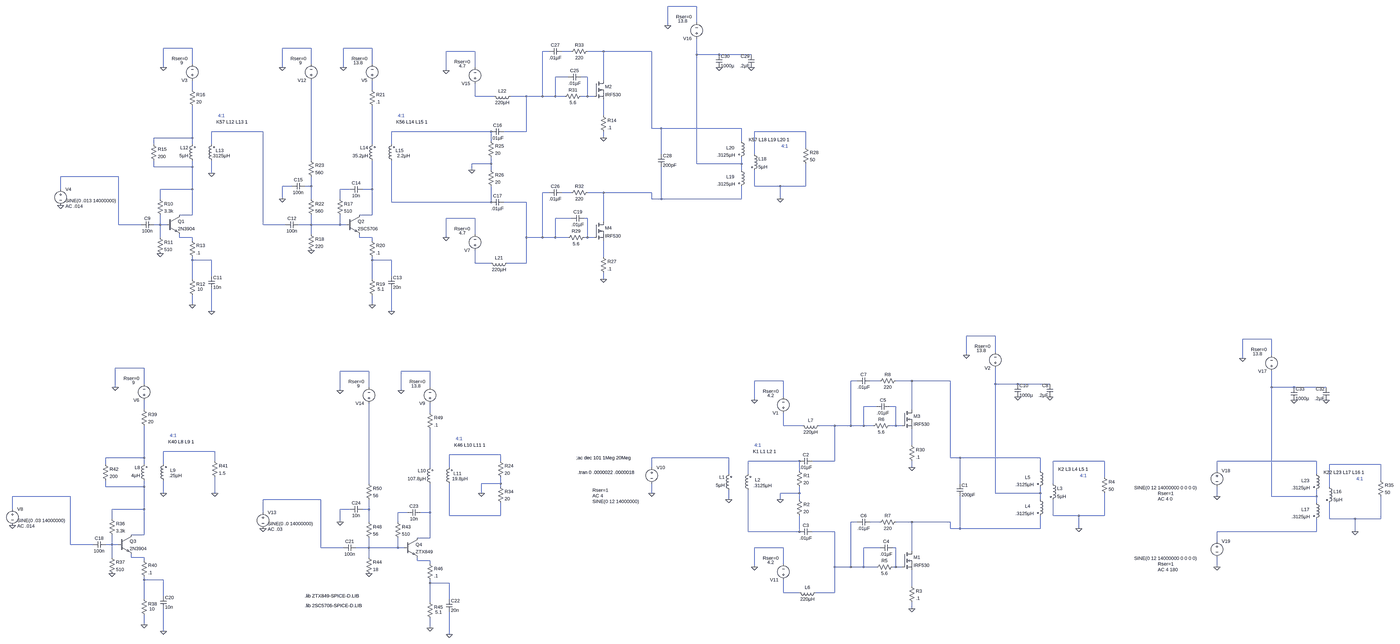
[diagram p0: schematic RF_AMP_2078_V306.asc, whole sheet]
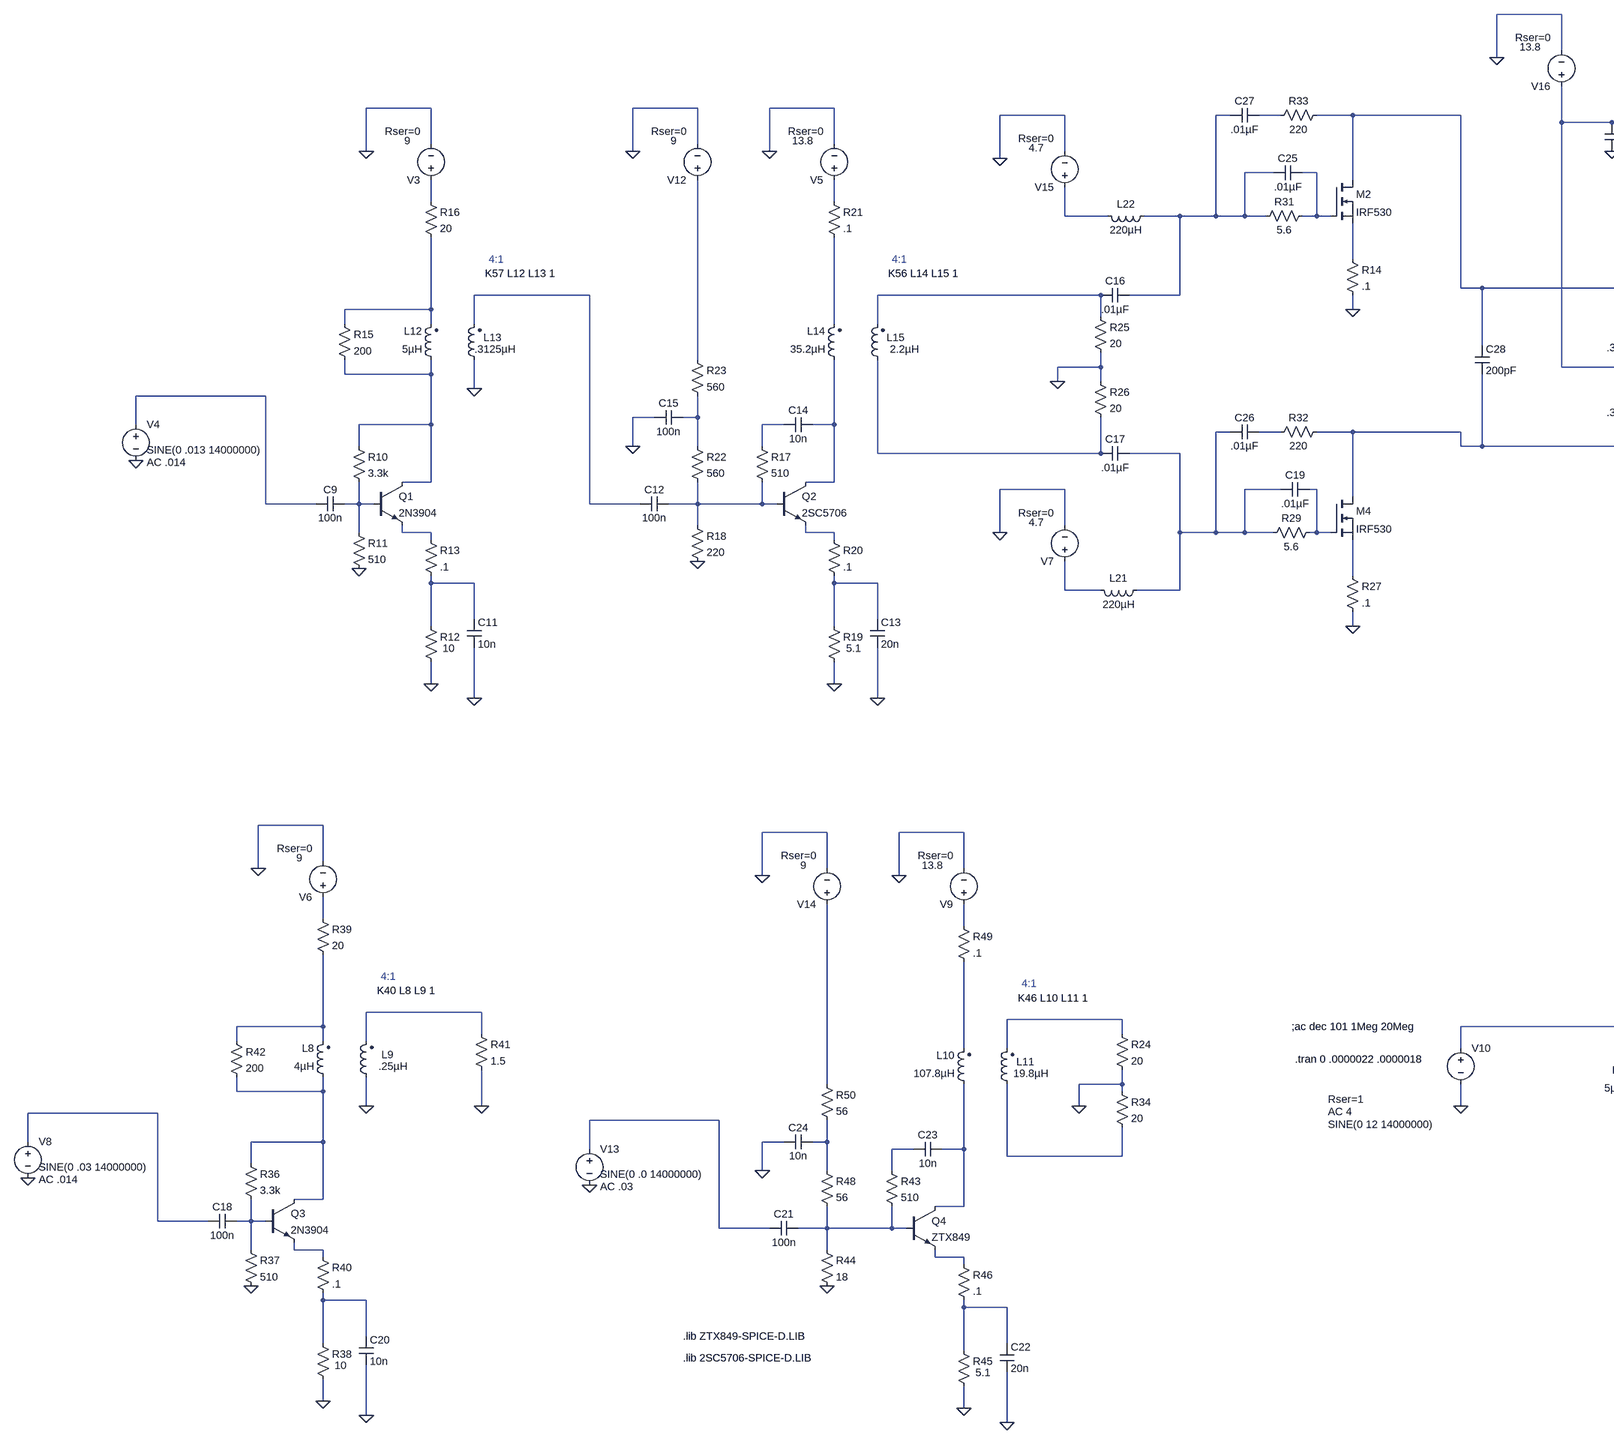
[diagram p1: schematic RF_AMP_2078_V306.asc, part, row 1 of 1, column 1 of 2]
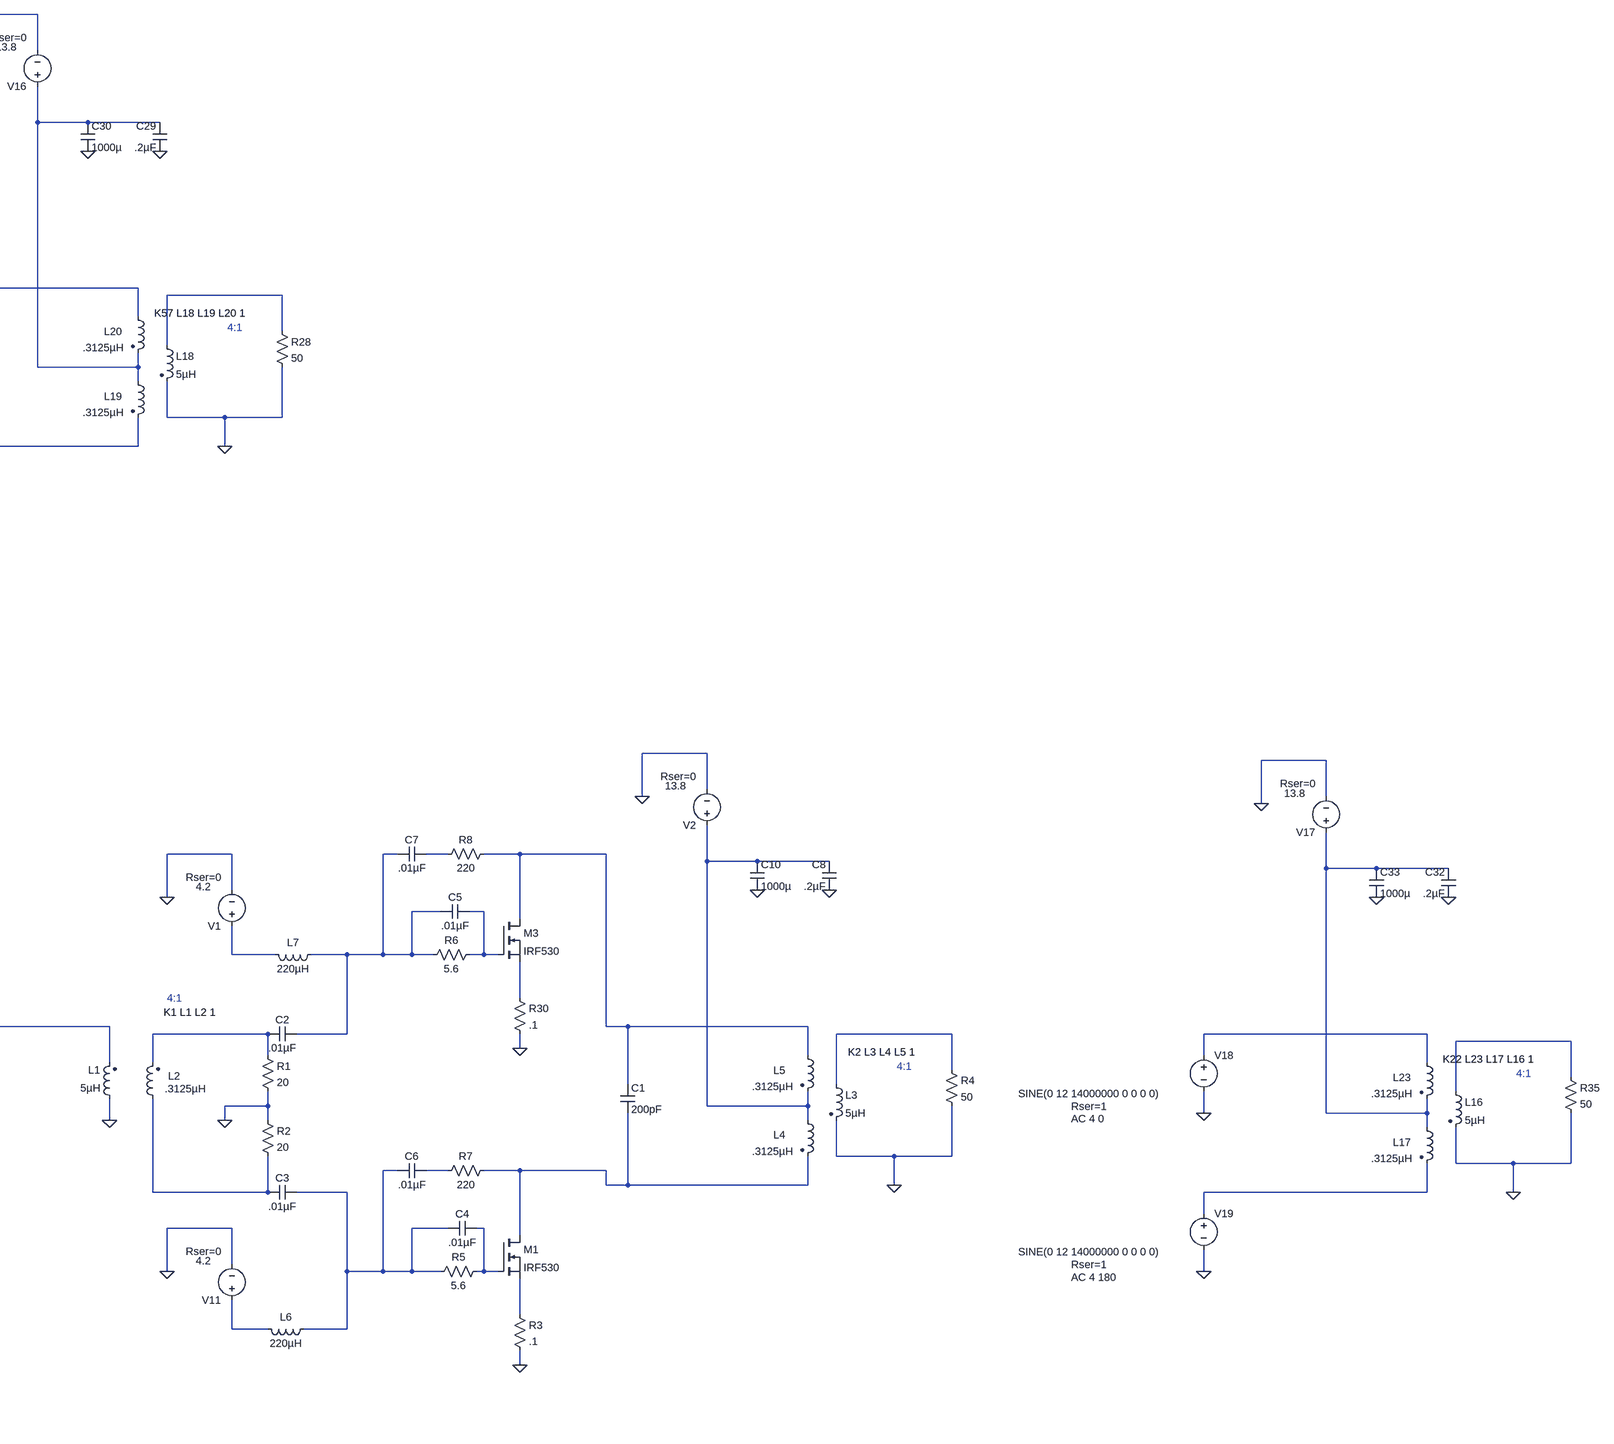
[diagram p2: schematic RF_AMP_2078_V306.asc, part, row 1 of 1, column 2 of 2]
RF_AMP_2078_V306.asc, the LTspice schematic file:
Version 4
SHEET 1 5652 1240
WIRE 2128 -4224 1984 -4224
WIRE 2128 -4144 2128 -4224
WIRE 1984 -4128 1984 -4224
WIRE -384 -4016 -528 -4016
WIRE 208 -4016 64 -4016
WIRE 512 -4016 368 -4016
WIRE 1024 -4000 880 -4000
WIRE 1392 -4000 1360 -4000
WIRE 1504 -4000 1456 -4000
WIRE 1664 -4000 1584 -4000
WIRE 1904 -4000 1664 -4000
WIRE 2128 -3984 2128 -4064
WIRE 2240 -3984 2128 -3984
WIRE 2400 -3984 2240 -3984
WIRE -384 -3936 -384 -4016
WIRE 208 -3936 208 -4016
WIRE 512 -3936 512 -4016
WIRE -528 -3920 -528 -4016
WIRE 64 -3920 64 -4016
WIRE 368 -3920 368 -4016
WIRE 1024 -3920 1024 -4000
WIRE 880 -3904 880 -4000
WIRE 1488 -3872 1424 -3872
WIRE 1584 -3872 1552 -3872
WIRE 1664 -3856 1664 -4000
WIRE -384 -3808 -384 -3856
WIRE 512 -3808 512 -3856
WIRE 1024 -3776 1024 -3840
WIRE 1120 -3776 1024 -3776
WIRE 1280 -3776 1200 -3776
WIRE 1360 -3776 1360 -4000
WIRE 1360 -3776 1280 -3776
WIRE 1424 -3776 1424 -3872
WIRE 1424 -3776 1360 -3776
WIRE 1472 -3776 1424 -3776
WIRE 1584 -3776 1584 -3872
WIRE 1584 -3776 1552 -3776
WIRE 1616 -3776 1584 -3776
WIRE 1664 -3680 1664 -3760
WIRE 1904 -3616 1904 -4000
WIRE 1952 -3616 1904 -3616
WIRE 2352 -3616 1952 -3616
WIRE -32 -3600 -288 -3600
WIRE 1104 -3600 608 -3600
WIRE 1280 -3600 1280 -3776
WIRE 1280 -3600 1168 -3600
WIRE 2672 -3600 2416 -3600
WIRE -384 -3568 -384 -3728
WIRE -384 -3568 -576 -3568
WIRE 1664 -3568 1664 -3600
WIRE 1104 -3552 1104 -3600
WIRE 2352 -3552 2352 -3616
WIRE -576 -3536 -576 -3568
WIRE -384 -3536 -384 -3568
WIRE -288 -3536 -288 -3600
WIRE 512 -3536 512 -3728
WIRE 608 -3536 608 -3600
WIRE 2672 -3520 2672 -3600
WIRE 1952 -3488 1952 -3616
WIRE 2416 -3488 2416 -3600
WIRE 208 -3456 208 -3856
WIRE 1104 -3440 1104 -3472
WIRE 1104 -3440 1008 -3440
WIRE 2128 -3440 2128 -3984
WIRE 2352 -3440 2352 -3472
WIRE 2352 -3440 2128 -3440
WIRE -576 -3424 -576 -3456
WIRE -384 -3424 -384 -3456
WIRE -384 -3424 -576 -3424
WIRE 1008 -3408 1008 -3440
WIRE 1104 -3408 1104 -3440
WIRE 2352 -3408 2352 -3440
WIRE -288 -3392 -288 -3456
WIRE -752 -3376 -1040 -3376
WIRE 112 -3328 64 -3328
WIRE 208 -3328 208 -3376
WIRE 208 -3328 176 -3328
WIRE 2416 -3328 2416 -3408
WIRE 2544 -3328 2416 -3328
WIRE 2672 -3328 2672 -3440
WIRE 2672 -3328 2544 -3328
WIRE -1040 -3312 -1040 -3376
WIRE -384 -3312 -384 -3424
WIRE -384 -3312 -544 -3312
WIRE 400 -3312 352 -3312
WIRE 512 -3312 512 -3456
WIRE 512 -3312 464 -3312
WIRE 1392 -3296 1360 -3296
WIRE 1504 -3296 1456 -3296
WIRE 1664 -3296 1584 -3296
WIRE 1904 -3296 1664 -3296
WIRE -544 -3264 -544 -3312
WIRE 64 -3264 64 -3328
WIRE 208 -3264 208 -3328
WIRE 352 -3264 352 -3312
WIRE 1904 -3264 1904 -3296
WIRE 1952 -3264 1952 -3424
WIRE 1952 -3264 1904 -3264
WIRE 2352 -3264 2352 -3328
WIRE 2352 -3264 1952 -3264
WIRE 2544 -3264 2544 -3328
WIRE 608 -3248 608 -3456
WIRE 1104 -3248 1104 -3328
WIRE 1104 -3248 608 -3248
WIRE 1280 -3248 1168 -3248
WIRE -384 -3184 -384 -3312
WIRE -384 -3184 -448 -3184
WIRE 512 -3184 512 -3312
WIRE 512 -3184 448 -3184
WIRE 1024 -3168 880 -3168
WIRE 1504 -3168 1424 -3168
WIRE 1584 -3168 1568 -3168
WIRE 1664 -3152 1664 -3296
WIRE -752 -3136 -752 -3376
WIRE -640 -3136 -752 -3136
WIRE -544 -3136 -544 -3184
WIRE -544 -3136 -576 -3136
WIRE -512 -3136 -544 -3136
WIRE -32 -3136 -32 -3600
WIRE 80 -3136 -32 -3136
WIRE 208 -3136 208 -3184
WIRE 208 -3136 144 -3136
WIRE 352 -3136 352 -3184
WIRE 352 -3136 208 -3136
WIRE 384 -3136 352 -3136
WIRE 208 -3088 208 -3136
WIRE 1024 -3088 1024 -3168
WIRE -544 -3072 -544 -3136
WIRE -448 -3072 -448 -3088
WIRE -384 -3072 -448 -3072
WIRE 448 -3072 448 -3088
WIRE 512 -3072 448 -3072
WIRE 880 -3072 880 -3168
WIRE 1280 -3072 1280 -3248
WIRE 1360 -3072 1360 -3296
WIRE 1360 -3072 1280 -3072
WIRE 1424 -3072 1424 -3168
WIRE 1424 -3072 1360 -3072
WIRE 1488 -3072 1424 -3072
WIRE 1584 -3072 1584 -3168
WIRE 1584 -3072 1568 -3072
WIRE 1616 -3072 1584 -3072
WIRE -384 -3056 -384 -3072
WIRE 512 -3056 512 -3072
WIRE 1664 -2976 1664 -3056
WIRE -384 -2960 -384 -2976
WIRE -288 -2960 -384 -2960
WIRE 512 -2960 512 -2976
WIRE 608 -2960 512 -2960
WIRE 1024 -2944 1024 -3008
WIRE 1104 -2944 1024 -2944
WIRE 1280 -2944 1280 -3072
WIRE 1280 -2944 1184 -2944
WIRE -288 -2880 -288 -2960
WIRE 608 -2880 608 -2960
WIRE -384 -2864 -384 -2960
WIRE 512 -2864 512 -2960
WIRE 1664 -2864 1664 -2896
WIRE -384 -2736 -384 -2784
WIRE 512 -2736 512 -2784
WIRE -288 -2704 -288 -2816
WIRE 608 -2704 608 -2816
WIRE 3664 -2000 3520 -2000
WIRE 5040 -1984 4896 -1984
WIRE 3664 -1920 3664 -2000
WIRE 3520 -1904 3520 -2000
WIRE 5040 -1904 5040 -1984
WIRE 4896 -1888 4896 -1984
WIRE -624 -1840 -768 -1840
WIRE 496 -1824 352 -1824
WIRE 800 -1824 656 -1824
WIRE 2560 -1776 2416 -1776
WIRE 2928 -1776 2896 -1776
WIRE 3040 -1776 2992 -1776
WIRE 3200 -1776 3120 -1776
WIRE 3440 -1776 3200 -1776
WIRE -624 -1760 -624 -1840
WIRE 3664 -1760 3664 -1840
WIRE 3776 -1760 3664 -1760
WIRE 3936 -1760 3776 -1760
WIRE -768 -1744 -768 -1840
WIRE 496 -1744 496 -1824
WIRE 800 -1744 800 -1824
WIRE 5040 -1744 5040 -1824
WIRE 5152 -1744 5040 -1744
WIRE 5312 -1744 5152 -1744
WIRE 352 -1728 352 -1824
WIRE 656 -1728 656 -1824
WIRE 2560 -1696 2560 -1776
WIRE 2416 -1680 2416 -1776
WIRE 3024 -1648 2960 -1648
WIRE 3120 -1648 3088 -1648
WIRE -624 -1632 -624 -1680
WIRE 3200 -1632 3200 -1776
WIRE 800 -1616 800 -1664
WIRE 2560 -1552 2560 -1616
WIRE 2656 -1552 2560 -1552
WIRE 2816 -1552 2736 -1552
WIRE 2896 -1552 2896 -1776
WIRE 2896 -1552 2816 -1552
WIRE 2960 -1552 2960 -1648
WIRE 2960 -1552 2896 -1552
WIRE 3008 -1552 2960 -1552
WIRE 3120 -1552 3120 -1648
WIRE 3120 -1552 3088 -1552
WIRE 3152 -1552 3120 -1552
WIRE 3200 -1456 3200 -1536
WIRE -272 -1424 -528 -1424
WIRE 1152 -1408 896 -1408
WIRE -624 -1392 -624 -1552
WIRE -624 -1392 -816 -1392
WIRE 2288 -1392 1904 -1392
WIRE 3440 -1392 3440 -1776
WIRE 3488 -1392 3440 -1392
WIRE 3888 -1392 3488 -1392
WIRE -272 -1376 -272 -1424
WIRE 1152 -1376 1152 -1408
WIRE 2640 -1376 2384 -1376
WIRE 2816 -1376 2816 -1552
WIRE 2816 -1376 2704 -1376
WIRE 4208 -1376 3952 -1376
WIRE 5264 -1376 4768 -1376
WIRE -816 -1360 -816 -1392
WIRE -624 -1360 -624 -1392
WIRE -528 -1360 -528 -1424
WIRE 5584 -1360 5328 -1360
WIRE 800 -1344 800 -1536
WIRE 896 -1344 896 -1408
WIRE 1904 -1344 1904 -1392
WIRE 3200 -1344 3200 -1376
WIRE 2640 -1328 2640 -1376
WIRE 3888 -1328 3888 -1392
WIRE 4768 -1328 4768 -1376
WIRE 2288 -1312 2288 -1392
WIRE 2384 -1312 2384 -1376
WIRE 5264 -1312 5264 -1376
WIRE 4208 -1296 4208 -1376
WIRE 5584 -1280 5584 -1360
WIRE 496 -1264 496 -1664
WIRE 1152 -1264 1152 -1296
WIRE 1152 -1264 1056 -1264
WIRE 3488 -1264 3488 -1392
WIRE 3952 -1264 3952 -1376
WIRE -816 -1248 -816 -1280
WIRE -624 -1248 -624 -1280
WIRE -624 -1248 -816 -1248
WIRE 1152 -1248 1152 -1264
WIRE 5328 -1248 5328 -1360
WIRE -528 -1216 -528 -1280
WIRE -272 -1216 -272 -1296
WIRE 1056 -1216 1056 -1264
WIRE 1904 -1216 1904 -1264
WIRE 2640 -1216 2640 -1248
WIRE 2640 -1216 2544 -1216
WIRE 3664 -1216 3664 -1760
WIRE 3888 -1216 3888 -1248
WIRE 3888 -1216 3664 -1216
WIRE -992 -1200 -1280 -1200
WIRE 4768 -1200 4768 -1248
WIRE 5040 -1200 5040 -1744
WIRE 5264 -1200 5264 -1232
WIRE 5264 -1200 5040 -1200
WIRE 256 -1184 -32 -1184
WIRE 2288 -1184 2288 -1232
WIRE 2544 -1184 2544 -1216
WIRE 2640 -1184 2640 -1216
WIRE 3888 -1184 3888 -1216
WIRE 5264 -1168 5264 -1200
WIRE -1280 -1136 -1280 -1200
WIRE -624 -1136 -624 -1248
WIRE -624 -1136 -784 -1136
WIRE 400 -1136 352 -1136
WIRE 496 -1136 496 -1184
WIRE 496 -1136 464 -1136
WIRE -32 -1120 -32 -1184
WIRE 688 -1120 640 -1120
WIRE 800 -1120 800 -1264
WIRE 800 -1120 752 -1120
WIRE 896 -1104 896 -1264
WIRE 1152 -1104 1152 -1168
WIRE 1152 -1104 896 -1104
WIRE 3952 -1104 3952 -1184
WIRE 4080 -1104 3952 -1104
WIRE 4208 -1104 4208 -1216
WIRE 4208 -1104 4080 -1104
WIRE -784 -1088 -784 -1136
WIRE 5328 -1088 5328 -1168
WIRE 5456 -1088 5328 -1088
WIRE 5584 -1088 5584 -1200
WIRE 5584 -1088 5456 -1088
WIRE 352 -1072 352 -1136
WIRE 496 -1072 496 -1136
WIRE 640 -1072 640 -1120
WIRE 2928 -1072 2896 -1072
WIRE 3040 -1072 2992 -1072
WIRE 3200 -1072 3120 -1072
WIRE 3440 -1072 3200 -1072
WIRE 3440 -1040 3440 -1072
WIRE 3488 -1040 3488 -1200
WIRE 3488 -1040 3440 -1040
WIRE 3888 -1040 3888 -1104
WIRE 3888 -1040 3488 -1040
WIRE 4080 -1040 4080 -1104
WIRE 2384 -1024 2384 -1232
WIRE 2640 -1024 2640 -1104
WIRE 2640 -1024 2384 -1024
WIRE 2816 -1024 2704 -1024
WIRE 5264 -1024 5264 -1088
WIRE 5264 -1024 4768 -1024
WIRE 5456 -1024 5456 -1088
WIRE -624 -1008 -624 -1136
WIRE -624 -1008 -688 -1008
WIRE 800 -992 800 -1120
WIRE 800 -992 736 -992
WIRE 4768 -976 4768 -1024
WIRE -992 -960 -992 -1200
WIRE -880 -960 -992 -960
WIRE -784 -960 -784 -1008
WIRE -784 -960 -816 -960
WIRE -752 -960 -784 -960
WIRE 256 -944 256 -1184
WIRE 368 -944 256 -944
WIRE 496 -944 496 -992
WIRE 496 -944 432 -944
WIRE 640 -944 640 -992
WIRE 640 -944 496 -944
WIRE 672 -944 640 -944
WIRE 2560 -944 2416 -944
WIRE 3040 -944 2960 -944
WIRE 3120 -944 3104 -944
WIRE 3200 -928 3200 -1072
WIRE -784 -896 -784 -960
WIRE -688 -896 -688 -912
WIRE -624 -896 -688 -896
WIRE 496 -896 496 -944
WIRE -624 -880 -624 -896
WIRE 736 -880 736 -896
WIRE 800 -880 736 -880
WIRE 800 -864 800 -880
WIRE 2560 -864 2560 -944
WIRE 2416 -848 2416 -944
WIRE 2816 -848 2816 -1024
WIRE 2896 -848 2896 -1072
WIRE 2896 -848 2816 -848
WIRE 2960 -848 2960 -944
WIRE 2960 -848 2896 -848
WIRE 3024 -848 2960 -848
WIRE 3120 -848 3120 -944
WIRE 3120 -848 3104 -848
WIRE 3152 -848 3120 -848
WIRE 4768 -848 4768 -896
WIRE -624 -784 -624 -800
WIRE -528 -784 -624 -784
WIRE 800 -768 800 -784
WIRE 896 -768 800 -768
WIRE 3200 -752 3200 -832
WIRE 2560 -720 2560 -784
WIRE 2640 -720 2560 -720
WIRE 2816 -720 2816 -848
WIRE 2816 -720 2720 -720
WIRE -528 -704 -528 -784
WIRE -624 -688 -624 -784
WIRE 896 -688 896 -768
WIRE 800 -672 800 -768
WIRE 3200 -640 3200 -672
WIRE -624 -560 -624 -608
WIRE 800 -544 800 -592
WIRE -528 -528 -528 -640
WIRE 896 -512 896 -624
FLAG 1904 -1216 0
FLAG 3200 -1344 0
FLAG -768 -1744 0
FLAG -784 -816 0
FLAG -624 -560 0
FLAG -528 -528 0
FLAG -528 -1216 0
FLAG -1280 -1056 0
FLAG -272 -1216 0
FLAG 656 -1728 0
FLAG 496 -816 0
FLAG 800 -544 0
FLAG 896 -512 0
FLAG -32 -1040 0
FLAG 352 -1072 0
FLAG 352 -1728 0
FLAG 2544 -1184 0
FLAG 3200 -640 0
FLAG 4080 -1040 0
FLAG 2416 -848 0
FLAG 2288 -1184 0
FLAG 2416 -1680 0
FLAG 3520 -1904 0
FLAG 3936 -1696 0
FLAG 3776 -1696 0
FLAG -528 -3920 0
FLAG -544 -2992 0
FLAG -384 -2736 0
FLAG -288 -2704 0
FLAG -288 -3392 0
FLAG -1040 -3232 0
FLAG 368 -3920 0
FLAG 208 -3008 0
FLAG 512 -2736 0
FLAG 608 -2704 0
FLAG 64 -3264 0
FLAG 64 -3920 0
FLAG 1664 -3568 0
FLAG 1008 -3408 0
FLAG 1664 -2864 0
FLAG 2544 -3264 0
FLAG 880 -3072 0
FLAG 880 -3904 0
FLAG 1984 -4128 0
FLAG 2400 -3920 0
FLAG 2240 -3920 0
FLAG 1056 -1216 0
FLAG 5456 -1024 0
FLAG 4896 -1888 0
FLAG 5312 -1680 0
FLAG 5152 -1680 0
FLAG 4768 -1200 0
FLAG 4768 -848 0
SYMBOL voltage 1904 -1360 R0
WINDOW 123 -295 157 Left 2
WINDOW 39 -295 129 Left 2
WINDOW 3 -295 185 Left 2
SYMATTR Value2 AC 4
SYMATTR SpiceLine Rser=1
SYMATTR Value SINE(0 12 14000000)
SYMATTR InstName V10
SYMBOL voltage 2560 -768 R180
WINDOW 123 0 0 Left 0
WINDOW 39 24 124 Left 2
WINDOW 3 46 103 Left 2
SYMATTR SpiceLine Rser=0
SYMATTR Value 4.2
SYMATTR InstName V11
SYMBOL nmos 3152 -1632 R0
SYMATTR InstName M3
SYMATTR Value IRF530
SYMBOL res 3184 -1472 R0
SYMATTR InstName R30
SYMATTR Value .1
SYMBOL npn -752 -1008 R0
SYMATTR InstName Q3
SYMATTR Value 2N3904
SYMBOL voltage -624 -1664 R180
WINDOW 123 0 0 Left 0
WINDOW 39 24 124 Left 2
WINDOW 3 46 103 Left 2
SYMATTR SpiceLine Rser=0
SYMATTR Value 9
SYMATTR InstName V6
SYMBOL cap -816 -976 R90
WINDOW 0 0 32 VBottom 2
WINDOW 3 32 32 VTop 2
SYMATTR InstName C18
SYMATTR Value 100n
SYMBOL res -800 -1104 R0
SYMATTR InstName R36
SYMATTR Value 3.3k
SYMBOL res -800 -912 R0
SYMATTR InstName R37
SYMATTR Value 510
SYMBOL res -640 -704 R0
WINDOW 3 42 65 Left 2
SYMATTR Value 10
SYMATTR InstName R38
SYMBOL cap -544 -704 R0
SYMATTR InstName C20
SYMATTR Value 10n
SYMBOL ind2 -608 -1264 R180
WINDOW 0 36 80 Left 2
WINDOW 3 36 40 Left 2
SYMATTR InstName L8
SYMATTR Value 4µH
SYMATTR Type ind
SYMBOL ind2 -512 -1264 R180
WINDOW 0 -45 66 Left 2
WINDOW 3 -76 40 Left 2
SYMATTR InstName L9
SYMATTR Value .25µH
SYMATTR Type ind
SYMBOL res -640 -896 R0
SYMATTR InstName R40
SYMATTR Value .1
SYMBOL voltage -1280 -1152 R0
WINDOW 123 24 100 Left 2
WINDOW 39 0 0 Left 0
WINDOW 3 24 72 Left 2
SYMATTR Value2 AC .014
SYMATTR Value SINE(0 .03 14000000)
SYMATTR InstName V8
SYMBOL res -288 -1392 R0
SYMATTR InstName R41
SYMATTR Value 1.5
SYMBOL res -832 -1376 R0
SYMATTR InstName R42
SYMATTR Value 200
SYMBOL res -640 -1648 R0
SYMATTR InstName R39
SYMATTR Value 20
SYMBOL npn 672 -992 R0
SYMATTR InstName Q4
SYMATTR Value ZTX849
SYMBOL voltage 800 -1648 R180
WINDOW 123 0 0 Left 0
WINDOW 39 24 124 Left 2
WINDOW 3 46 103 Left 2
SYMATTR SpiceLine Rser=0
SYMATTR Value 13.8
SYMATTR InstName V9
SYMBOL cap 432 -960 R90
WINDOW 0 0 32 VBottom 2
WINDOW 3 32 32 VTop 2
SYMATTR InstName C21
SYMATTR Value 100n
SYMBOL res 624 -1088 R0
SYMATTR InstName R43
SYMATTR Value 510
SYMBOL res 480 -912 R0
SYMATTR InstName R44
SYMATTR Value 18
SYMBOL res 784 -688 R0
WINDOW 3 42 65 Left 2
SYMATTR Value 5.1
SYMATTR InstName R45
SYMBOL cap 880 -688 R0
SYMATTR InstName C22
SYMATTR Value 20n
SYMBOL ind2 816 -1248 R180
WINDOW 0 36 80 Left 2
WINDOW 3 36 40 Left 2
SYMATTR InstName L10
SYMATTR Value 107.8µH
SYMATTR Type ind
SYMBOL ind2 912 -1248 R180
WINDOW 0 -45 66 Left 2
WINDOW 3 -76 40 Left 2
SYMATTR InstName L11
SYMATTR Value 19.8µH
SYMATTR Type ind
SYMBOL res 784 -880 R0
SYMATTR InstName R46
SYMATTR Value .1
SYMBOL voltage -32 -1136 R0
WINDOW 123 24 100 Left 2
WINDOW 39 0 0 Left 0
WINDOW 3 24 72 Left 2
SYMATTR Value2 AC .03
SYMATTR Value SINE(0 .0 14000000)
SYMATTR InstName V13
SYMBOL res 784 -1632 R0
SYMATTR InstName R49
SYMATTR Value .1
SYMBOL cap 752 -1136 R90
WINDOW 0 0 32 VBottom 2
WINDOW 3 32 32 VTop 2
SYMATTR InstName C23
SYMATTR Value 10n
SYMBOL res 480 -1088 R0
SYMATTR InstName R48
SYMATTR Value 56
SYMBOL res 480 -1280 R0
SYMATTR InstName R50
SYMATTR Value 56
SYMBOL cap 464 -1152 R90
WINDOW 0 0 32 VBottom 2
WINDOW 3 32 32 VTop 2
SYMATTR InstName C24
SYMATTR Value 10n
SYMBOL voltage 496 -1648 R180
WINDOW 123 0 0 Left 0
WINDOW 39 24 124 Left 2
WINDOW 3 46 103 Left 2
SYMATTR SpiceLine Rser=0
SYMATTR Value 9
SYMATTR InstName V14
SYMBOL ind2 2304 -1216 R180
WINDOW 0 36 80 Left 2
WINDOW 3 36 40 Left 2
SYMATTR InstName L1
SYMATTR Value 5µH
SYMATTR Type ind
SYMBOL ind2 2400 -1216 R180
WINDOW 0 -45 66 Left 2
WINDOW 3 -102 38 Left 2
SYMATTR InstName L2
SYMATTR Value .3125µH
SYMATTR Type ind
SYMBOL res 2624 -1344 R0
SYMATTR InstName R1
SYMATTR Value 20
SYMBOL res 2624 -1200 R0
SYMATTR InstName R2
SYMATTR Value 20
SYMBOL nmos 3152 -928 R0
SYMATTR InstName M1
SYMATTR Value IRF530
SYMBOL res 3184 -768 R0
SYMATTR InstName R3
SYMATTR Value .1
SYMBOL ind2 3936 -1280 R0
SYMATTR InstName L3
SYMATTR Value 5µH
SYMATTR Type ind
SYMBOL ind2 3872 -1200 R0
WINDOW 0 -60 49 Left 2
WINDOW 3 -108 85 Left 2
SYMATTR InstName L4
SYMATTR Value .3125µH
SYMATTR Type ind
SYMBOL res 4192 -1312 R0
SYMATTR InstName R4
SYMATTR Value 50
SYMBOL cap 2704 -1392 R90
WINDOW 0 0 32 VBottom 2
WINDOW 3 32 32 VTop 2
SYMATTR InstName C2
SYMATTR Value .01µF
SYMBOL cap 2704 -1040 R90
WINDOW 0 0 32 VBottom 2
WINDOW 3 32 32 VTop 2
SYMATTR InstName C3
SYMATTR Value .01µF
SYMBOL res 3120 -864 R90
WINDOW 0 0 56 VBottom 2
WINDOW 3 32 56 VTop 2
SYMATTR InstName R5
SYMATTR Value 5.6
SYMBOL cap 3104 -960 R90
WINDOW 0 0 32 VBottom 2
WINDOW 3 32 32 VTop 2
SYMATTR InstName C4
SYMATTR Value .01µF
SYMBOL res 3104 -1568 R90
WINDOW 0 0 56 VBottom 2
WINDOW 3 32 56 VTop 2
SYMATTR InstName R6
SYMATTR Value 5.6
SYMBOL cap 3088 -1664 R90
WINDOW 0 0 32 VBottom 2
WINDOW 3 32 32 VTop 2
SYMATTR InstName C5
SYMATTR Value .01µF
SYMBOL res 3136 -1088 R90
WINDOW 0 0 56 VBottom 2
WINDOW 3 32 56 VTop 2
SYMATTR InstName R7
SYMATTR Value 220
SYMBOL cap 2992 -1088 R90
WINDOW 0 0 32 VBottom 2
WINDOW 3 32 32 VTop 2
SYMATTR InstName C6
SYMATTR Value .01µF
SYMBOL res 3136 -1792 R90
WINDOW 0 0 56 VBottom 2
WINDOW 3 32 56 VTop 2
SYMATTR InstName R8
SYMATTR Value 220
SYMBOL cap 2992 -1792 R90
WINDOW 0 0 32 VBottom 2
WINDOW 3 32 32 VTop 2
SYMATTR InstName C7
SYMATTR Value .01µF
SYMBOL ind2 3872 -1344 R0
WINDOW 0 -60 49 Left 2
WINDOW 3 -108 85 Left 2
SYMATTR InstName L5
SYMATTR Value .3125µH
SYMATTR Type ind
SYMBOL cap 3472 -1264 R0
SYMATTR InstName C1
SYMATTR Value 200pF
SYMBOL voltage 2560 -1600 R180
WINDOW 123 0 0 Left 0
WINDOW 39 24 124 Left 2
WINDOW 3 46 103 Left 2
SYMATTR SpiceLine Rser=0
SYMATTR Value 4.2
SYMATTR InstName V1
SYMBOL voltage 3664 -1824 R180
WINDOW 123 0 0 Left 0
WINDOW 39 24 124 Left 2
WINDOW 3 46 103 Left 2
SYMATTR SpiceLine Rser=0
SYMATTR Value 13.8
SYMATTR InstName V2
SYMBOL ind 2736 -736 R90
WINDOW 0 5 56 VBottom 2
WINDOW 3 32 56 VTop 2
SYMATTR InstName L6
SYMATTR Value 220µH
SYMBOL ind 2752 -1568 R90
WINDOW 0 5 56 VBottom 2
WINDOW 3 32 56 VTop 2
SYMATTR InstName L7
SYMATTR Value 220µH
SYMBOL cap 3952 -1696 R180
WINDOW 0 24 56 Left 2
WINDOW 3 24 8 Left 2
SYMATTR InstName C8
SYMATTR Value .2µF
SYMBOL cap 3760 -1760 R0
SYMATTR InstName C10
SYMATTR Value 1000µ
SYMBOL npn -512 -3184 R0
SYMATTR InstName Q1
SYMATTR Value 2N3904
SYMBOL voltage -384 -3840 R180
WINDOW 123 0 0 Left 0
WINDOW 39 24 124 Left 2
WINDOW 3 46 103 Left 2
SYMATTR SpiceLine Rser=0
SYMATTR Value 9
SYMATTR InstName V3
SYMBOL cap -576 -3152 R90
WINDOW 0 0 32 VBottom 2
WINDOW 3 32 32 VTop 2
SYMATTR InstName C9
SYMATTR Value 100n
SYMBOL res -560 -3280 R0
SYMATTR InstName R10
SYMATTR Value 3.3k
SYMBOL res -560 -3088 R0
SYMATTR InstName R11
SYMATTR Value 510
SYMBOL res -400 -2880 R0
WINDOW 3 42 65 Left 2
SYMATTR Value 10
SYMATTR InstName R12
SYMBOL cap -304 -2880 R0
SYMATTR InstName C11
SYMATTR Value 10n
SYMBOL ind2 -368 -3440 R180
WINDOW 0 36 80 Left 2
WINDOW 3 36 40 Left 2
SYMATTR InstName L12
SYMATTR Value 5µH
SYMATTR Type ind
SYMBOL ind2 -272 -3440 R180
WINDOW 0 -45 66 Left 2
WINDOW 3 -76 40 Left 2
SYMATTR InstName L13
SYMATTR Value .3125µH
SYMATTR Type ind
SYMBOL res -400 -3072 R0
SYMATTR InstName R13
SYMATTR Value .1
SYMBOL voltage -1040 -3328 R0
WINDOW 123 24 100 Left 2
WINDOW 39 0 0 Left 0
WINDOW 3 24 72 Left 2
SYMATTR Value2 AC .014
SYMATTR Value SINE(0 .013 14000000)
SYMATTR InstName V4
SYMBOL res -592 -3552 R0
SYMATTR InstName R15
SYMATTR Value 200
SYMBOL res -400 -3824 R0
SYMATTR InstName R16
SYMATTR Value 20
SYMBOL npn 384 -3184 R0
SYMATTR InstName Q2
SYMATTR Value 2SC5706
SYMBOL voltage 512 -3840 R180
WINDOW 123 0 0 Left 0
WINDOW 39 24 124 Left 2
WINDOW 3 46 103 Left 2
SYMATTR SpiceLine Rser=0
SYMATTR Value 13.8
SYMATTR InstName V5
SYMBOL cap 144 -3152 R90
WINDOW 0 0 32 VBottom 2
WINDOW 3 32 32 VTop 2
SYMATTR InstName C12
SYMATTR Value 100n
SYMBOL res 336 -3280 R0
SYMATTR InstName R17
SYMATTR Value 510
SYMBOL res 192 -3104 R0
SYMATTR InstName R18
SYMATTR Value 220
SYMBOL res 496 -2880 R0
WINDOW 3 42 65 Left 2
SYMATTR Value 5.1
SYMATTR InstName R19
SYMBOL cap 592 -2880 R0
SYMATTR InstName C13
SYMATTR Value 20n
SYMBOL ind2 528 -3440 R180
WINDOW 0 36 80 Left 2
WINDOW 3 36 40 Left 2
SYMATTR InstName L14
SYMATTR Value 35.2µH
SYMATTR Type ind
SYMBOL ind2 624 -3440 R180
WINDOW 0 -45 66 Left 2
WINDOW 3 -76 40 Left 2
SYMATTR InstName L15
SYMATTR Value 2.2µH
SYMATTR Type ind
SYMBOL res 496 -3072 R0
SYMATTR InstName R20
SYMATTR Value .1
SYMBOL res 496 -3824 R0
SYMATTR InstName R21
SYMATTR Value .1
SYMBOL cap 464 -3328 R90
WINDOW 0 0 32 VBottom 2
WINDOW 3 32 32 VTop 2
SYMATTR InstName C14
SYMATTR Value 10n
SYMBOL res 192 -3280 R0
SYMATTR InstName R22
SYMATTR Value 560
SYMBOL res 192 -3472 R0
SYMATTR InstName R23
SYMATTR Value 560
SYMBOL cap 176 -3344 R90
WINDOW 0 0 32 VBottom 2
WINDOW 3 32 32 VTop 2
SYMATTR InstName C15
SYMATTR Value 100n
SYMBOL voltage 208 -3840 R180
WINDOW 123 0 0 Left 0
WINDOW 39 24 124 Left 2
WINDOW 3 46 103 Left 2
SYMATTR SpiceLine Rser=0
SYMATTR Value 9
SYMATTR InstName V12
SYMBOL voltage 1024 -2992 R180
WINDOW 123 0 0 Left 0
WINDOW 39 24 124 Left 2
WINDOW 3 46 103 Left 2
SYMATTR SpiceLine Rser=0
SYMATTR Value 4.7
SYMATTR InstName V7
SYMBOL nmos 1616 -3856 R0
SYMATTR InstName M2
SYMATTR Value IRF530
SYMBOL res 1648 -3696 R0
SYMATTR InstName R14
SYMATTR Value .1
SYMBOL res 1088 -3568 R0
SYMATTR InstName R25
SYMATTR Value 20
SYMBOL res 1088 -3424 R0
SYMATTR InstName R26
SYMATTR Value 20
SYMBOL nmos 1616 -3152 R0
SYMATTR InstName M4
SYMATTR Value IRF530
SYMBOL res 1648 -2992 R0
SYMATTR InstName R27
SYMATTR Value .1
SYMBOL ind2 2400 -3504 R0
SYMATTR InstName L18
SYMATTR Value 5µH
SYMATTR Type ind
SYMBOL ind2 2336 -3424 R0
WINDOW 0 -60 49 Left 2
WINDOW 3 -108 85 Left 2
SYMATTR InstName L19
SYMATTR Value .3125µH
SYMATTR Type ind
SYMBOL res 2656 -3536 R0
SYMATTR InstName R28
SYMATTR Value 50
SYMBOL cap 1168 -3616 R90
WINDOW 0 0 32 VBottom 2
WINDOW 3 32 32 VTop 2
SYMATTR InstName C16
SYMATTR Value .01µF
SYMBOL cap 1168 -3264 R90
WINDOW 0 0 32 VBottom 2
WINDOW 3 32 32 VTop 2
SYMATTR InstName C17
SYMATTR Value .01µF
SYMBOL res 1584 -3088 R90
WINDOW 0 0 56 VBottom 2
WINDOW 3 32 56 VTop 2
SYMATTR InstName R29
SYMATTR Value 5.6
SYMBOL cap 1568 -3184 R90
WINDOW 0 0 32 VBottom 2
WINDOW 3 32 32 VTop 2
SYMATTR InstName C19
SYMATTR Value .01µF
SYMBOL res 1568 -3792 R90
WINDOW 0 0 56 VBottom 2
WINDOW 3 32 56 VTop 2
SYMATTR InstName R31
SYMATTR Value 5.6
SYMBOL cap 1552 -3888 R90
WINDOW 0 0 32 VBottom 2
WINDOW 3 32 32 VTop 2
SYMATTR InstName C25
SYMATTR Value .01µF
SYMBOL res 1600 -3312 R90
WINDOW 0 0 56 VBottom 2
WINDOW 3 32 56 VTop 2
SYMATTR InstName R32
SYMATTR Value 220
SYMBOL cap 1456 -3312 R90
WINDOW 0 0 32 VBottom 2
WINDOW 3 32 32 VTop 2
SYMATTR InstName C26
SYMATTR Value .01µF
SYMBOL res 1600 -4016 R90
WINDOW 0 0 56 VBottom 2
WINDOW 3 32 56 VTop 2
SYMATTR InstName R33
SYMATTR Value 220
SYMBOL cap 1456 -4016 R90
WINDOW 0 0 32 VBottom 2
WINDOW 3 32 32 VTop 2
SYMATTR InstName C27
SYMATTR Value .01µF
SYMBOL ind2 2336 -3568 R0
WINDOW 0 -60 49 Left 2
WINDOW 3 -108 85 Left 2
SYMATTR InstName L20
SYMATTR Value .3125µH
SYMATTR Type ind
SYMBOL cap 1936 -3488 R0
SYMATTR InstName C28
SYMATTR Value 200pF
SYMBOL voltage 1024 -3824 R180
WINDOW 123 0 0 Left 0
WINDOW 39 24 124 Left 2
WINDOW 3 46 103 Left 2
SYMATTR SpiceLine Rser=0
SYMATTR Value 4.7
SYMATTR InstName V15
SYMBOL voltage 2128 -4048 R180
WINDOW 123 0 0 Left 0
WINDOW 39 24 124 Left 2
WINDOW 3 46 103 Left 2
SYMATTR SpiceLine Rser=0
SYMATTR Value 13.8
SYMATTR InstName V16
SYMBOL ind 1200 -2960 R90
WINDOW 0 5 56 VBottom 2
WINDOW 3 32 56 VTop 2
SYMATTR InstName L21
SYMATTR Value 220µH
SYMBOL ind 1216 -3792 R90
WINDOW 0 5 56 VBottom 2
WINDOW 3 32 56 VTop 2
SYMATTR InstName L22
SYMATTR Value 220µH
SYMBOL cap 2416 -3920 R180
WINDOW 0 24 56 Left 2
WINDOW 3 24 8 Left 2
SYMATTR InstName C29
SYMATTR Value .2µF
SYMBOL cap 2224 -3984 R0
SYMATTR InstName C30
SYMATTR Value 1000µ
SYMBOL res 1136 -1392 R0
SYMATTR InstName R24
SYMATTR Value 20
SYMBOL res 1136 -1264 R0
SYMATTR InstName R34
SYMATTR Value 20
SYMBOL ind2 5312 -1264 R0
SYMATTR InstName L16
SYMATTR Value 5µH
SYMATTR Type ind
SYMBOL ind2 5248 -1184 R0
WINDOW 0 -60 49 Left 2
WINDOW 3 -108 85 Left 2
SYMATTR InstName L17
SYMATTR Value .3125µH
SYMATTR Type ind
SYMBOL res 5568 -1296 R0
SYMATTR InstName R35
SYMATTR Value 50
SYMBOL ind2 5248 -1328 R0
WINDOW 0 -60 49 Left 2
WINDOW 3 -108 85 Left 2
SYMATTR InstName L23
SYMATTR Value .3125µH
SYMATTR Type ind
SYMBOL voltage 5040 -1808 R180
WINDOW 123 0 0 Left 0
WINDOW 39 24 124 Left 2
WINDOW 3 46 103 Left 2
SYMATTR SpiceLine Rser=0
SYMATTR Value 13.8
SYMATTR InstName V17
SYMBOL cap 5328 -1680 R180
WINDOW 0 24 56 Left 2
WINDOW 3 24 8 Left 2
SYMATTR InstName C32
SYMATTR Value .2µF
SYMBOL cap 5136 -1744 R0
SYMATTR InstName C33
SYMATTR Value 1000µ
SYMBOL voltage 4768 -1344 R0
WINDOW 123 -295 157 Left 2
WINDOW 39 -295 129 Left 2
WINDOW 3 -412 101 Left 2
SYMATTR Value2 AC 4 0
SYMATTR SpiceLine Rser=1
SYMATTR Value SINE(0 12 14000000 0 0 0 0)
SYMATTR InstName V18
SYMBOL voltage 4768 -992 R0
WINDOW 123 -295 157 Left 2
WINDOW 39 -295 129 Left 2
WINDOW 3 -412 101 Left 2
SYMATTR Value2 AC 4 180
SYMATTR SpiceLine Rser=1
SYMATTR Value SINE(0 12 14000000 0 0 0 0)
SYMATTR InstName V19
TEXT 1536 -1320 Left 2 !.tran 0 .0000022 .0000018
TEXT -504 -1472 Left 2 !K40 L8 L9 1
TEXT -496 -1504 Left 2 ;4:1
TEXT 920 -1456 Left 2 !K46 L10 L11 1
TEXT 928 -1488 Left 2 ;4:1
TEXT 2408 -1424 Left 2 !K1 L1 L2 1
TEXT 2416 -1456 Left 2 ;4:1
TEXT 4128 -1336 Right 2 !K2 L3 L4 L5 1
TEXT 4120 -1304 Right 2 ;4:1
TEXT 176 -656 Left 2 !.lib 2SC5706-SPICE-D.LIB
TEXT 1528 -1392 Left 2 !;ac dec 101 1Meg 20Meg
TEXT -264 -3648 Left 2 !K57 L12 L13 1
TEXT -256 -3680 Left 2 ;4:1
TEXT 632 -3648 Left 2 !K56 L14 L15 1
TEXT 640 -3680 Left 2 ;4:1
TEXT 2592 -3560 Right 2 !K57 L18 L19 L20 1
TEXT 2584 -3528 Right 2 ;4:1
TEXT 5504 -1320 Right 2 !K22 L23 L17 L16 1
TEXT 5496 -1288 Right 2 ;4:1
TEXT 176 -704 Left 2 !.lib ZTX849-SPICE-D.LIB

The netlist it stands for:
* RF_AMP_2078_V306.asc
V10 N047 0 SINE(0 12 14000000) AC 4 Rser=1
V11 N074 0 4.2 Rser=0
M3 N036 N039 N043 N043 IRF530
R30 N043 0 .1
Q3 N054 N066 N069 0 2N3904
V6 N040 0 9 Rser=0
C18 N066 N055 100n
R36 N054 N066 3.3k
R37 N066 0 510
R38 N071 0 10
C20 N071 0 10n
L8 N054 N046 4µH
L9 0 N044 .25µH
R40 N069 N071 .1
V8 N055 0 SINE(0 .03 14000000) AC .014
R41 N044 0 1.5
R42 N046 N054 200
R39 N040 N046 20
Q4 N059 N067 N070 0 ZTX849
V9 N041 0 13.8 Rser=0
C21 N067 N056 100n
R43 N058 N067 510
R44 N067 0 18
R45 N072 0 5.1
C22 N072 0 20n
L10 N059 N052 107.8µH
L11 N060 N045 19.8µH
R46 N070 N072 .1
V13 N056 0 SINE(0 .0 14000000) AC .03
R49 N041 N052 .1
C23 N059 N058 10n
R48 N057 N067 56
R50 N053 N057 56
C24 N057 0 10n
V14 N053 0 9 Rser=0
L1 0 N047 5µH
L2 N064 N048 .3125µH
R1 N048 0 20
R2 0 N064 20
M1 N063 N068 N073 N073 IRF530
R3 N073 0 .1
L3 N049 0 5µH
L4 N037 N063 .3125µH
R4 N049 0 50
C2 N034 N048 .01µF
C3 N061 N064 .01µF
R5 N068 N061 5.6
C4 N068 N061 .01µF
R6 N039 N034 5.6
C5 N039 N034 .01µF
R7 N063 N062 220
C6 N062 N061 .01µF
R8 N036 N035 220
C7 N035 N034 .01µF
L5 N036 N037 .3125µH
C1 N036 N063 200pF
V1 N042 0 4.2 Rser=0
V2 N037 0 13.8 Rser=0
L6 N061 N074 220µH
L7 N034 N042 220µH
C8 0 N037 .2µF
C10 N037 0 1000µ
Q1 N016 N026 N028 0 2N3904
V3 N006 0 9 Rser=0
C9 N026 N017 100n
R10 N016 N026 3.3k
R11 N026 0 510
R12 N031 0 10
C11 N031 0 10n
L12 N016 N013 5µH
L13 0 N010 .3125µH
R13 N028 N031 .1
V4 N017 0 SINE(0 .013 14000000) AC .014
R15 N013 N016 200
R16 N006 N013 20
Q2 N020 N027 N029 0 2SC5706
V5 N007 0 13.8 Rser=0
C12 N027 N010 100n
R17 N019 N027 510
R18 N027 0 220
R19 N032 0 5.1
C13 N032 0 20n
L14 N020 N014 35.2µH
L15 N024 N011 2.2µH
R20 N029 N032 .1
R21 N007 N014 .1
C14 N020 N019 10n
R22 N018 N027 560
R23 N015 N018 560
C15 N018 0 100n
V12 N015 0 9 Rser=0
V7 N033 0 4.7 Rser=0
M2 N003 N005 N009 N009 IRF530
R14 N009 0 .1
R25 N011 0 20
R26 0 N024 20
M4 N023 N025 N030 N030 IRF530
R27 N030 0 .1
L18 N012 0 5µH
L19 N004 N023 .3125µH
R28 N012 0 50
C16 N001 N011 .01µF
C17 N021 N024 .01µF
R29 N025 N021 5.6
C19 N025 N021 .01µF
R31 N005 N001 5.6
C25 N005 N001 .01µF
R32 N023 N022 220
C26 N022 N021 .01µF
R33 N003 N002 220
C27 N002 N001 .01µF
L20 N003 N004 .3125µH
C28 N003 N023 200pF
V15 N008 0 4.7 Rser=0
V16 N004 0 13.8 Rser=0
L21 N021 N033 220µH
L22 N001 N008 220µH
C29 0 N004 .2µF
C30 N004 0 1000µ
R24 N045 0 20
R34 0 N060 20
L16 N051 0 5µH
L17 N038 N065 .3125µH
R35 N051 0 50
L23 N050 N038 .3125µH
V17 N038 0 13.8 Rser=0
C32 0 N038 .2µF
C33 N038 0 1000µ
V18 N050 0 SINE(0 12 14000000 0 0 0 0) AC 4 0 Rser=1
V19 N065 0 SINE(0 12 14000000 0 0 0 0) AC 4 180 Rser=1
.model NPN NPN
.model PNP PNP
.lib standard.bjt
.model NMOS NMOS
.model PMOS PMOS
.lib standard.mos
.tran 0 .0000022 .0000018
K40 L8 L9 1
* 4:1
K46 L10 L11 1
* 4:1
K1 L1 L2 1
* 4:1
K2 L3 L4 L5 1
* 4:1
.lib 2SC5706-SPICE-D.LIB
;ac dec 101 1Meg 20Meg
K57 L12 L13 1
* 4:1
K56 L14 L15 1
* 4:1
K57 L18 L19 L20 1
* 4:1
K22 L23 L17 L16 1
* 4:1
.lib ZTX849-SPICE-D.LIB
.backanno
.end